# Altium schematic sheet Power.SchDoc: fNIRS - Power
size A4; CompanyName: UofT Capstone Team 2024991; DrawnBy: Tony Kim; Revision: 1; SheetNumber: 2; SheetTotal: 13
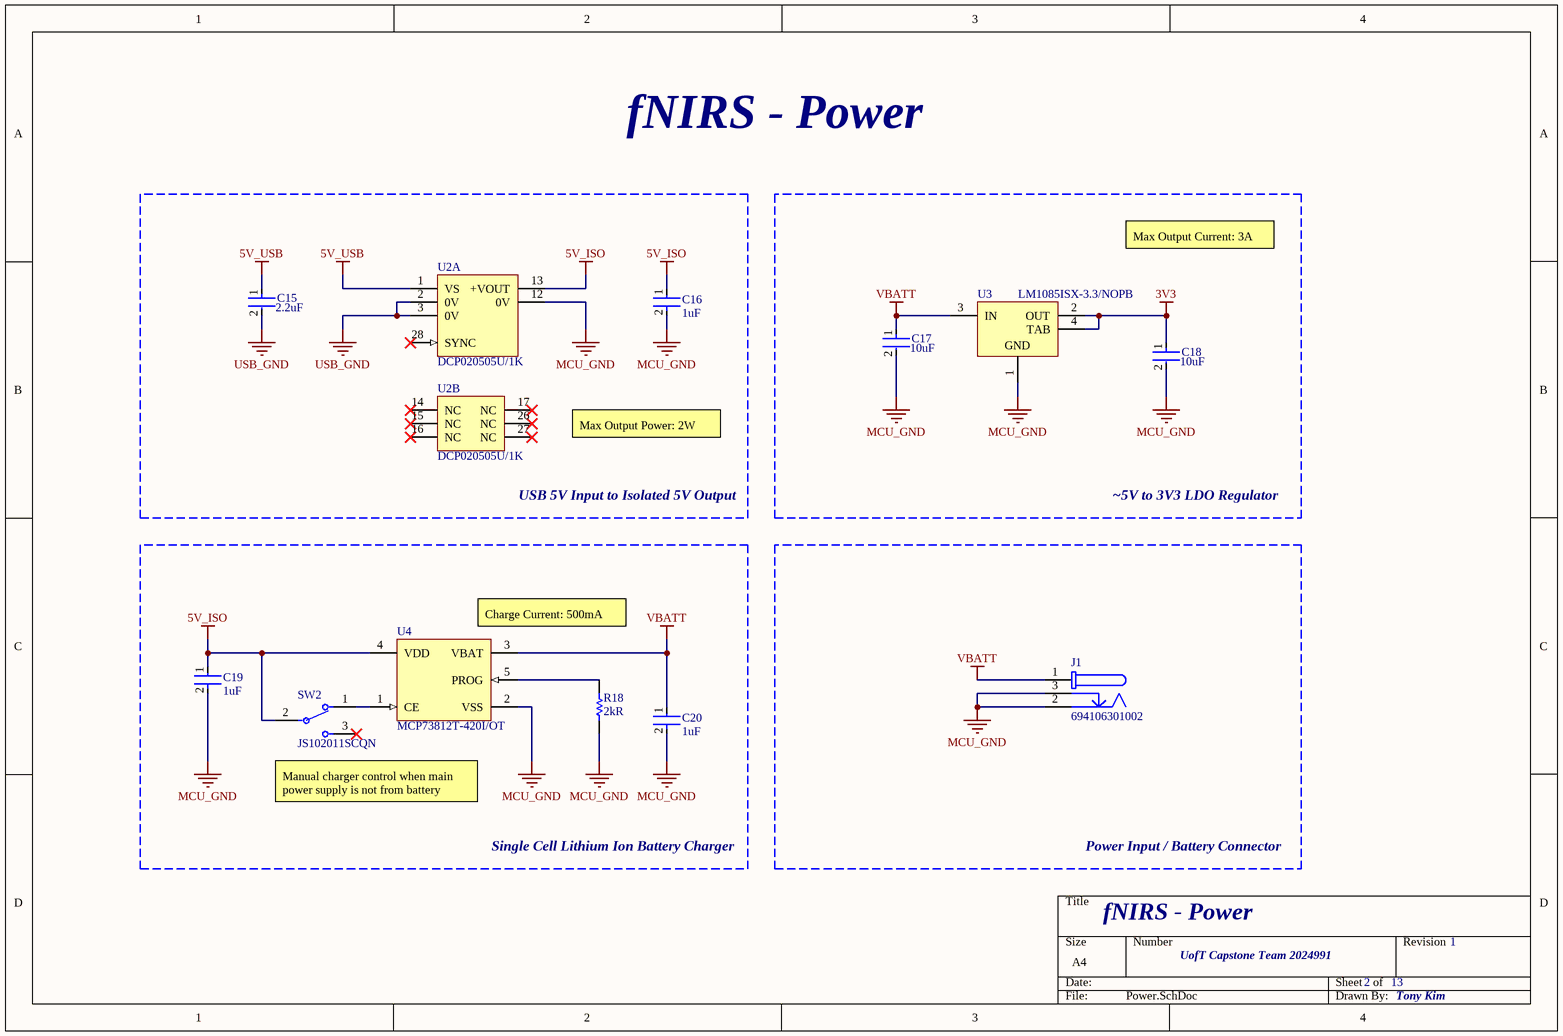
[diagram p0: Power.SchDoc]

## Parts
C15  Capacitance: 2.2uF  [FP-GRM188-0_1-e0_2_0_5-MFG]  (hidden comment: GRM188R61E225KA12D)
C16  Capacitance: 1uF  [FP-C1608-080-0_1-IPC_B]  (hidden comment: C1608X5R1H105K080AB)
C17  Capacitance: 10uF  [FP-GRM188-0_2-MFG]  (hidden comment: GRM188R61E106MA73D)
C18  Capacitance: 10uF  [FP-GRM188-0_2-MFG]  (hidden comment: GRM188R61E106MA73D)
C19  Capacitance: 1uF  [FP-C1608-080-0_1-IPC_B]  (hidden comment: C1608X5R1H105K080AB)
C20  Capacitance: 1uF  [FP-C1608-080-0_1-IPC_B]  (hidden comment: C1608X5R1H105K080AB)
J1  694106301002  [694106301002]
R18  Resistance: 2kR  [RESC1609X50X30ML10T20]  (hidden comment: CRCW06032K00FKEA)
SW2  JS102011SCQN  [FP-JS102011SCQN-MFG]
U2  DCP020505U/1K  [DVB0012A_L]  (parts A,B of 2)
U3  LM1085ISX-3.3/NOPB  [KTT0003B_M]
U4  MCP73812T-420I/OT  [SOT-23-OT5_M]

## Blocks framed on the sheet
USB 5V Input to Isolated 5V Output: C15 C16 U2
~5V to 3V3 LDO Regulator: C17 C18 U3
Single Cell Lithium Ion Battery Charger: C19 C20 R18 SW2 U4
Power Input / Battery Connector: J1

## Nets
3V3: C18.1 U3.2(OUT) U3.4(TAB)
5V_ISO: C16.1 C19.1 SW2.2(C) U2.13(+VOUT) U4.4(VDD)
5V_USB: C15.1 U2.1(VS)
MCU_GND: C16.2 C17.2 C18.2 C19.2 C20.2 J1.2 J1.3 R18.1 U2.12(0V) U3.1(GND) U4.2(VSS)
USB_GND: C15.2 U2.2(0V) U2.3(0V)
VBATT: C17.1 C20.1 J1.1 U3.3(IN) U4.3(VBAT)
NetR18_2: R18.2 U4.5(PROG)
NetSW2_1: SW2.1 U4.1(CE)

Not connected (* = marked no-connect by the designer): SW2 3*; U2 14(NC)* 15(NC)* 16(NC)* 17(NC)* 26(NC)* 27(NC)* 28(SYNC)*

## Notes on the sheet
- fNIRS - Power
- Max Output Current: 3A
- Max Output Power: 2W
- (near U4) Charge Current: 500mA
- (near SW2) Manual charger control when main power supply is not from battery

## Library data of the parts
C15 = CMP-2006-02820-2: Chip Multilayer Ceramic Capacitors for General Purpose, 0603, 2.2uF, X5R, 15%, 10%, 25V; Number of Pins: 2; Dielectric: X5R; Tolerance: 10%; Case Code (Imperial): 0603; Thickness: 0.035inch; Case/Package: 0603; Lead Free: Lead Free; Mount: Surface Mount; Material: Ceramic; Depth: 0.8mm; Voltage: 25V; Min Operating Temperature: -55°C; Package Quantity: 4000; REACH SVHC: No SVHC; Resistor Type: Ceramic; Packaging: Tape and Reel; Case Code (Metric): 1608; Max Operating Temperature: 85°C; Width: 0.8mm; Termination: SMD/SMT; Voltage Rating: 25V; Length: 1.6mm; Voltage Rating (DC): 25V; Height: 0.8mm; Radiation Hardening: No; Weight: 0.000222oz
C16 C19 C20 = CMP-2000-06025-2: Multilayer Ceramic Capacitors 1μF ±10% 50V X5R SMD 0603; Lead Free: Lead Free; Height: 0.8mm; Mount: Surface Mount; Radiation Hardening: No; Thickness: 0.035inch; Length: 1.6mm; Max Operating Temperature: 85°C; REACH SVHC: No SVHC; Min Operating Temperature: -55°C; Construction: Flat; RoHS Compliant: Yes; Voltage Rating: 50V; Dielectric: X5R; Packaging: Tape and Reel; Termination: SMD/SMT; Voltage Rating (DC): 50V; Case Code (Imperial): 0603; Voltage: 50V; Width: 0.031inch; Weight: 7.1E-05oz; Depth: 0.8mm; Case Code (Metric): 1608; Series: C; Case/Package: 0603; Tolerance: 10%; Resistor Type: Ceramic; Number of Pins: 2; Dielectric Material: Ceramic; Package Quantity: 1
C17 C18 = CMP-2006-02520-2: Chip Multilayer Ceramic Capacitors for General Purpose, 0603, 10uF, X5R, 15%, 20%, 25V; Tolerance: 20%; Resistor Type: Ceramic; Voltage: 25V; Max Operating Temperature: 85°C; Min Operating Temperature: -55°C; Dielectric: X5R; Lead Free: Lead Free; REACH SVHC: No SVHC; Case/Package: 0603; Mount: Surface Mount; Voltage Rating (DC): 25V; Height: 0.8mm; Length: 1.6mm; Thickness: 0.031inch; Width: 0.031inch; Termination: SMD/SMT; Case Code (Imperial): 0603; Case Code (Metric): 1608; Package Quantity: 1; Packaging: Tape and Reel; Depth: 0.8mm; Voltage Rating: 25V; Weight: 0.000222oz; Number of Pins: 2
J1 = CMP-1502-00188-2: NexarPartId: 52676100; Voltage Rating (DC): 20V; Gender: Male; Voltage Rating: 24V; Connector Type: Power; Insulation Resistance: 100MΩ; Current Rating: 5A; Shielding: Unshielded; Number of Contacts: 3; Color: Black; Housing Material: Polyamide; Contact Gender: Female; REACH SVHC: Unknown; Termination: Through Hole; Height: 11mm; RoHS: Compliant; Mount: Through Hole; Flammability Rating: UL94 V-0; Packaging: Bulk; Min Operating Temperature: -40°C; Contact Plating: Tin; Max Operating Temperature: 85°C; Operating Supply Voltage: 24V; Contact Material: Gold, Tin
R18 = CMP-2000-03159-1: Manufacturer: Vishay Dale; Part Number: CRCW06032K00FKEA
SW2 = CMP-10038-000023-1: SWITCH SLIDE SPDT 300MA 6V; Electrical Life: 5000Cycles; Actuator Type: Standard; Contact Resistance: 70mR; Actuator Material: Nylon; Max Voltage Rating (DC): 30V; Actuator Length: 2mm; Switch Function: On-On; Actuator Color: Black; Radiation Hardening: No; Throw Configuration: SPDT; Depth: 7.5mm; Case/Package: SMD/SMT; Package Quantity: 4000; Min Operating Temperature: -40°C; Length: 8.5mm; Current Rating: 300mA; Mount: Surface Mount; Voltage Rating (DC): 6V; RoHS Compliant: Yes; Orientation: Straight; Housing Material: Nylon; Contact Plating: Silver; Max Operating Temperature: 85°C; Packaging: Tape and Reel; Switch Travel: 2mm; Max Current Rating: 300mA; Contact Material: Copper Alloy; Series: JS; Termination: Gull Wing
U2 = CMP-0387-00170-2: Miniature, 2 W Isolated Unregulated DC-DC Converter, -40 to 85 degC, 12-pin SOP (DVB12), Pb-Free (RoHS); Manufacturer: Texas Instruments; SubFamily: 1 W & 2 W Miniature; Vin(Max)(V): 5.5; Iout(Max)(A): 0.4; Regulated Outputs(#): 1; Vout(Max)(V): 5.25; Vout(Min)(V): 4.75; Vin(Min)(V): 4.5; ComponentLink2URL: http://www.ti.com/general/docs/lit/getliterature.tsp?genericPartNumber=DCP020505&fileType=pdf; PackageReference: DVB0012A; Eco-Plan: Pb-Free (RoHS); ComponentLink4Description: URL Link1; ComponentLink2Description: Datasheet; ComponentLink1URL: http://www.ti.com/; ComponentLink3Description: Package Specification; Code_JEDEC: MS-013-AE; ComponentLink4URL: Samples URL:http://www.ti.com/product/dcp020505#samples; ComponentLink1Description: Manufacturer URL; DatasheetVersion: SBVS011K; PackageDescription: 12-Pin Plastic Small Outline, Body 17.9 x 7.5 mm; PartNumber: DCP020505U/1K; Mounting Technology: Surface Mount; PackageVersion: 4202104/B; ComponentLink3URL: http://www.ti.com/lit/ml/mpds106a/mpds106a.pdf
U3 = CMP-0062-00579-5: 3A Low Dropout Positive Regulators, 3-pin TO-263, Pb-Free; Manufacturer: Texas Instruments; PackageTopMarking: NSUZXYTTE#*LM1085*IS-3.3; PowerWise: N; High-Reliability: Y; CompType: LDO IC; PartNumber: LM1085ISX-3.3/NOPB; PinCount: 3; Code_JEDEC: MO-169-AA; ComponentLink1URL: http://www.ti.com/general/docs/lit/getliterature.tsp?genericPartNumber=LM1085&fileType=pdf; PackageReference: KTT0003B; PackageDescription: TO-263, Molded, .400 x .390 x .180in, 3 Lead, .1in Pitch, Surface Mount; ComponentLink1Description: Datasheet URL; RoHS: Y
U4 = CMP-0133-00141-1: Simple, Miniature Single-Cell, Fully Integrated Li-Ion/Li-Polymer Charge Management Controller, 4.2V, 5-Pin SOT-23, Industrial Temperature, Tape and Reel; PackageReference: SOT-23-OT5; PackageVersion: revBB, Aug-2009; PackageDescription: 5-Lead Plastic Small Outline Transistor (OT) [SOT-23]; Code_IPC: SOT23-5; DatasheetVersion: revB, Sep-2007